# Altium schematic sheet PX4FMUv2.4.6_1.SchDoc: PX4FMUv2.4.6
size 282 x 200 mm; Date: 2020/2/15 15:44:24; SheetNumber: 2; GateName_1: G$1; SymbolName_1: A4L-LOC; LibraryName: pixhawk2; DeviceSetName: A4L-LOC
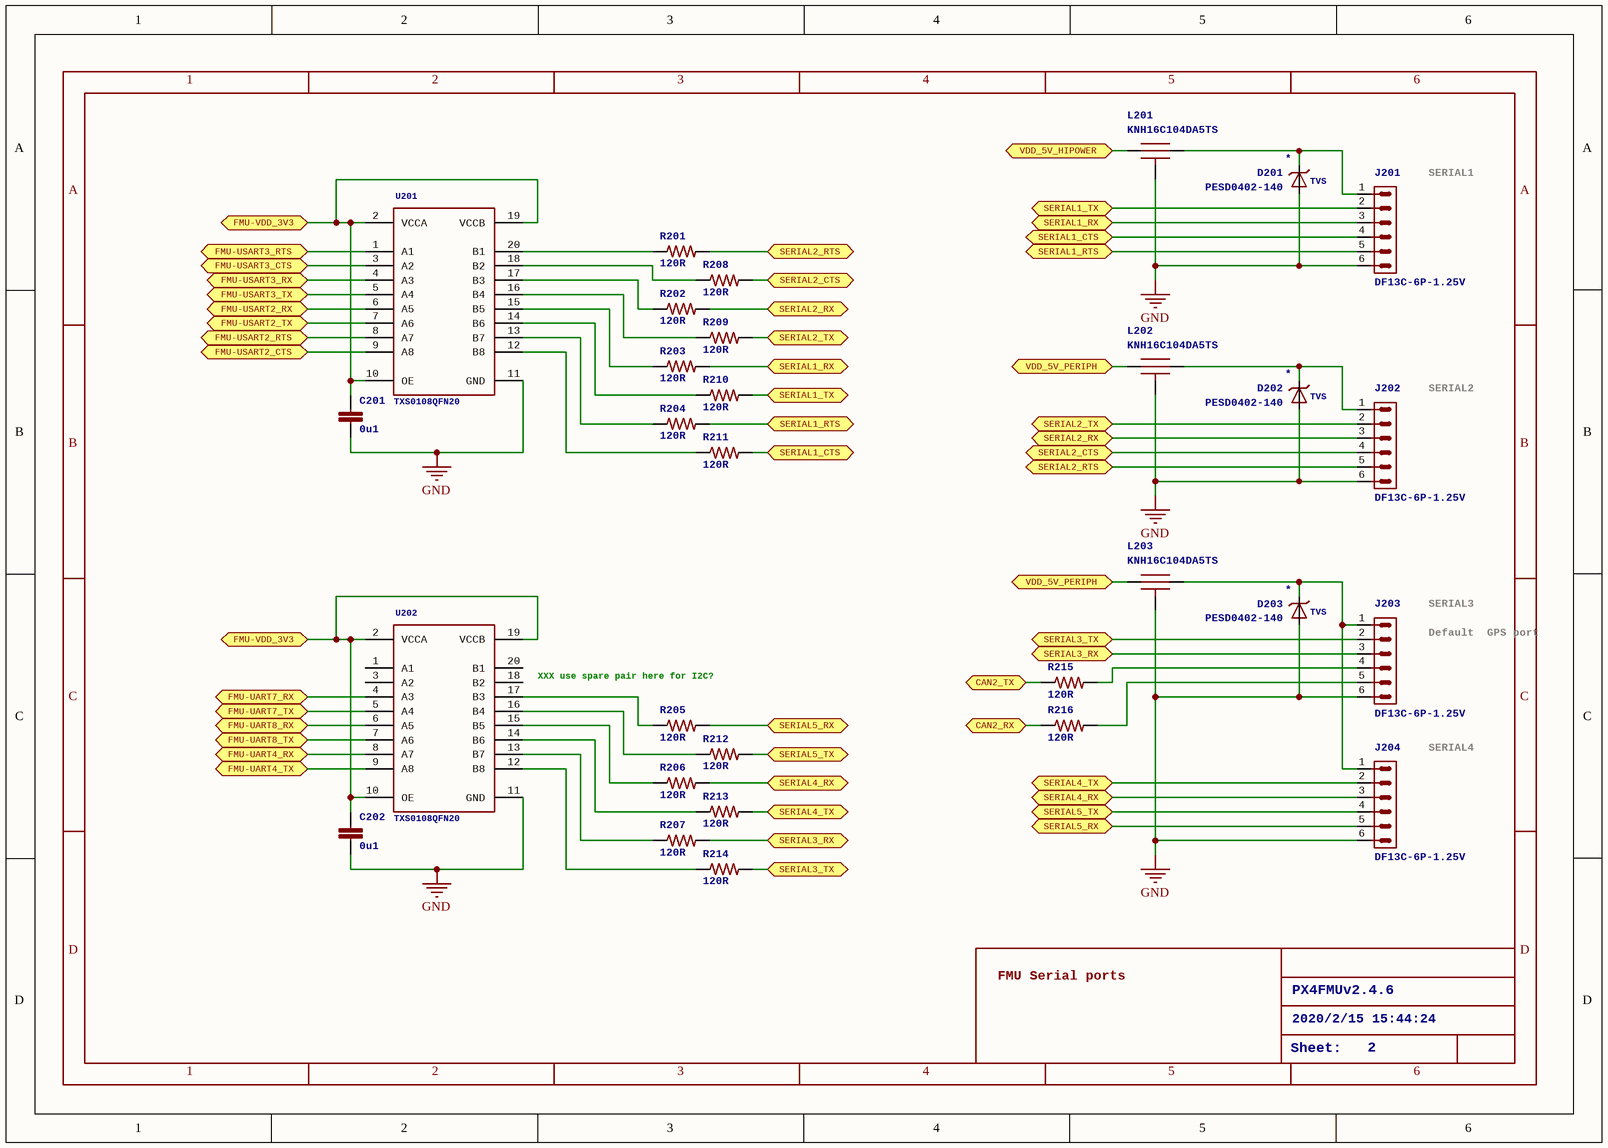
[diagram p0: PX4FMUv2.4.6_1.SchDoc]

## Parts
C201  0u1  [0402-CAP]
C202  0u1  [0402-CAP]
D201  PESD0402-140  [0402-TVS]
D202  PESD0402-140  [0402-TVS]
D203  PESD0402-140  [0402-TVS]
J201  DF13C-6P-1.25V  [DF13C-6P-1.25V]
J202  DF13C-6P-1.25V  [DF13C-6P-1.25V]
J203  DF13C-6P-1.25V  [DF13C-6P-1.25V]
J204  DF13C-6P-1.25V  [DF13C-6P-1.25V]
L201  KNH16C104DA5TS  [KYOCERA-KNH16-DA]
L202  KNH16C104DA5TS  [KYOCERA-KNH16-DA]
L203  KNH16C104DA5TS  [KYOCERA-KNH16-DA]
R201  120R  [0402-RES]
R202  120R  [0402-RES]
R203  120R  [0402-RES]
R204  120R  [0402-RES]
R205  120R  [0402-RES]
R206  120R  [0402-RES]
R207  120R  [0402-RES]
R208  120R  [0402-RES]
R209  120R  [0402-RES]
R210  120R  [0402-RES]
R211  120R  [0402-RES]
R212  120R  [0402-RES]
R213  120R  [0402-RES]
R214  120R  [0402-RES]
R215  120R  [0402-RES]
R216  120R  [0402-RES]
U201  TXS0108QFN20  [QFN20-RGY]
U202  TXS0108QFN20  [QFN20-RGY]

## Ports
CAN2_RX, CAN2_TX, FMU-UART4_RX, FMU-UART4_TX, FMU-UART7_RX, FMU-UART7_TX, FMU-UART8_RX, FMU-UART8_TX, FMU-USART2_CTS, FMU-USART2_RTS, FMU-USART2_RX, FMU-USART2_TX, FMU-USART3_CTS, FMU-USART3_RTS, FMU-USART3_RX, FMU-USART3_TX, FMU-VDD_3V3, SERIAL1_CTS, SERIAL1_RTS, SERIAL1_RX, SERIAL1_TX, SERIAL2_CTS, SERIAL2_RTS, SERIAL2_RX, SERIAL2_TX, SERIAL3_RX, SERIAL3_TX, SERIAL4_RX, SERIAL4_TX, SERIAL5_RX, SERIAL5_TX, VDD_5V_HIPOWER, VDD_5V_PERIPH

## Nets
GND: C201.P$2 C202.P$2 D201.A D202.A D203.A J201.6 J202.6 J203.6 J204.6 L201.P$3_P$4_P$5(P$3) L202.P$3_P$4_P$5(P$3) L203.P$3_P$4_P$5(P$3) U201.11(GND) U202.11(GND)
CAN2_RX: R216.P$1 ; port CAN2_RX
CAN2_TX: R215.P$1 ; port CAN2_TX
FMU-UART4_RX: U202.8(A7) ; port FMU-UART4_RX
FMU-UART4_TX: U202.9(A8) ; port FMU-UART4_TX
FMU-UART7_RX: U202.4(A3) ; port FMU-UART7_RX
FMU-UART7_TX: U202.5(A4) ; port FMU-UART7_TX
FMU-UART8_RX: U202.6(A5) ; port FMU-UART8_RX
FMU-UART8_TX: U202.7(A6) ; port FMU-UART8_TX
FMU-USART2_CTS: U201.9(A8) ; port FMU-USART2_CTS
FMU-USART2_RTS: U201.8(A7) ; port FMU-USART2_RTS
FMU-USART2_RX: U201.6(A5) ; port FMU-USART2_RX
FMU-USART2_TX: U201.7(A6) ; port FMU-USART2_TX
FMU-USART3_CTS: U201.3(A2) ; port FMU-USART3_CTS
FMU-USART3_RTS: U201.1(A1) ; port FMU-USART3_RTS
FMU-USART3_RX: U201.4(A3) ; port FMU-USART3_RX
FMU-USART3_TX: U201.5(A4) ; port FMU-USART3_TX
FMU-VDD_3V3: C201.P$1 C202.P$1 U201.2(VCCA) U201.10(OE) U201.19(VCCB) U202.2(VCCA) U202.10(OE) U202.19(VCCB) ; port FMU-VDD_3V3
SERIAL1_CTS: J201.4 R211.P$2 ; port SERIAL1_CTS
SERIAL1_RTS: J201.5 R204.P$2 ; port SERIAL1_RTS
SERIAL1_RX: J201.3 R203.P$2 ; port SERIAL1_RX
SERIAL1_TX: J201.2 R210.P$2 ; port SERIAL1_TX
SERIAL2_CTS: J202.4 R208.P$2 ; port SERIAL2_CTS
SERIAL2_RTS: J202.5 R201.P$2 ; port SERIAL2_RTS
SERIAL2_RX: J202.3 R202.P$2 ; port SERIAL2_RX
SERIAL2_TX: J202.2 R209.P$2 ; port SERIAL2_TX
SERIAL3_RX: J203.3 R207.P$2 ; port SERIAL3_RX
SERIAL3_TX: J203.2 R214.P$2 ; port SERIAL3_TX
SERIAL4_RX: J204.3 R206.P$2 ; port SERIAL4_RX
SERIAL4_TX: J204.2 R213.P$2 ; port SERIAL4_TX
SERIAL5_RX: J204.5 R205.P$2 ; port SERIAL5_RX
SERIAL5_TX: J204.4 R212.P$2 ; port SERIAL5_TX
VDD_5V_HIPOWER: L201.P$1 ; port VDD_5V_HIPOWER
VDD_5V_PERIPH: L202.P$1 L203.P$1 ; port VDD_5V_PERIPH
NetD201_C: D201.C J201.1 L201.P$2
NetD202_C: D202.C J202.1 L202.P$2
NetD203_C: D203.C J203.1 J204.1 L203.P$2
NetJ203_4: J203.4 R215.P$2
NetJ203_5: J203.5 R216.P$2
NetR201_P$1: R201.P$1 U201.20(B1)
NetR202_P$1: R202.P$1 U201.17(B3)
NetR203_P$1: R203.P$1 U201.15(B5)
NetR204_P$1: R204.P$1 U201.13(B7)
NetR205_P$1: R205.P$1 U202.17(B3)
NetR206_P$1: R206.P$1 U202.15(B5)
NetR207_P$1: R207.P$1 U202.13(B7)
NetR208_P$1: R208.P$1 U201.18(B2)
NetR209_P$1: R209.P$1 U201.16(B4)
NetR210_P$1: R210.P$1 U201.14(B6)
NetR211_P$1: R211.P$1 U201.12(B8)
NetR212_P$1: R212.P$1 U202.16(B4)
NetR213_P$1: R213.P$1 U202.14(B6)
NetR214_P$1: R214.P$1 U202.12(B8)

Not connected (* = marked no-connect by the designer): U202 1(A1) 3(A2) 18(B2) 20(B1)

## Notes on the sheet
- SERIAL1
- SERIAL2
- SERIAL3
- Default
  GPS port
- XXX use spare pair here for I2C?
- SERIAL4
- FMU Serial ports
- PX4FMUv2.4.6
- 2020/2/15 15:44:24
- Sheet:
- 2
- 1
- 3
- 4
- 5
- 6
- A
- B
- C
- D

## Library data of the parts
C201 C202 = CAP0402: CapacitorStandard 0603 ceramic capacitor, and 0.1" leaded capacitor.; PARTNO: CC0402ZRY5V7BB104; GateName_1: G$1; SymbolName_1: CAP; DeviceName: 0402; LibraryName: pixhawk2; DeviceSetName: CAP
D201-D203 = DIODE-TVS: GateName_1: G$1; SymbolName_1: DIODE-TVS; LibraryName: pixhawk2; DeviceSetName: DIODE-TVS; NAME: *; PARTNO: PESD0402-140; TVS: TVS
J201-J204 = DF13-6P-1.25V: DF13-6P 1.25mm Pitch Miniature Crimping Connector.; PARTNO: DF13C-6P-1.25V(20); GateName_1: G$1; SymbolName_1: CON-1X6P; DeviceName: V; LibraryName: con-hirose-df13; DeviceSetName: DF13-6P-1.25
L201-L203 = KNH16C104DA5TS: Kyocera KNH16C104DA5TS EMI filter; GateName_1: G$1; SymbolName_1: CAP-FEEDTHROUGH; LibraryName: pixhawk2; DeviceSetName: KNH16C104DA5TS; PARTNO: KNH16C104DA5TS
R201-R216 = RESISTOR0402-RES: ResistorBasic schematic elements and footprints for 0603, 1206, and PTH 1/10th watt (small) resistors.; PARTNO: RC0402FR-07120RL; GateName_1: G$1; SymbolName_1: RESISTOR; DeviceName: 0402-RES; LibraryName: pixhawk2; DeviceSetName: RESISTOR
U201 U202 = TXS0108QFN20: PARTNO: TXS0108ERGYR; GateName_1: G$1; SymbolName_1: TX?0108; DeviceName: QFN20; LibraryName: pixhawk2; DeviceSetName: TXS0108